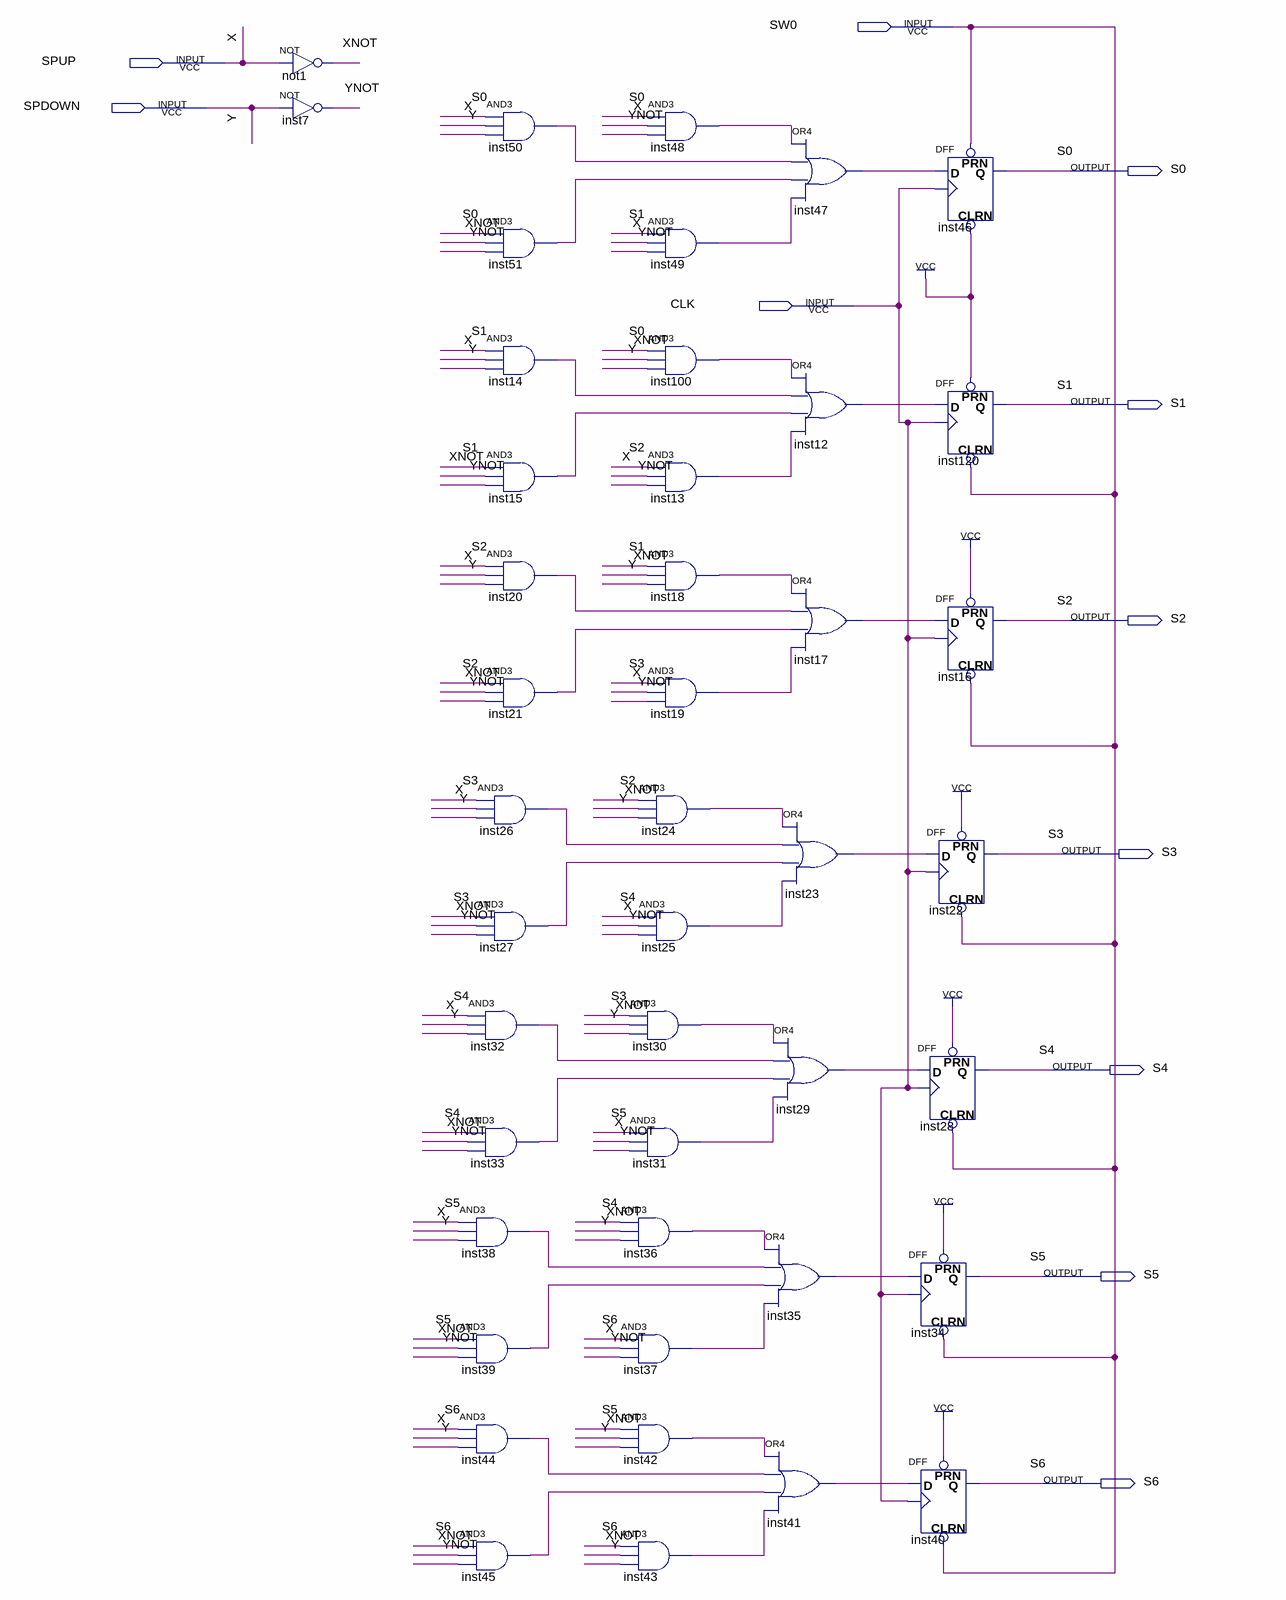
[diagram p0: schematic sheet]
// Quartus schematic nextstatelogic.bdf as structural Verilog: 44 symbols, 11 pins
module nextstatelogic (
  input  SW0,
  input  SPUP,
  input  SPDOWN,
  input  CLK,
  output S0,
  output S1,
  output S2,
  output S3,
  output S4,
  output S5,
  output S6
);

  wire inst12_out, inst13_out, inst14_out, inst15_out, inst17_out, inst18_out, inst19_out, inst20_out,
       inst21_out, inst23_out, inst24_out, inst25_out, inst26_out, inst27_out, inst29_out, inst30_out,
       inst31_out, inst32_out, inst33_out, inst35_out, inst36_out, inst37_out, inst38_out, inst39_out,
       inst41_out, inst42_out, inst43_out, inst44_out, inst45_out, inst47_out, inst48_out, inst49_out,
       inst50_out, inst51_out, inst100_out, XNOT, YNOT;

  not not1 (XNOT, SPUP);
  not inst7 (YNOT, SPDOWN);
  and inst50 (inst50_out, S0, SPUP, SPDOWN);
  and inst51 (inst51_out, S0, XNOT, YNOT);
  and inst14 (inst14_out, S1, SPUP, SPDOWN);
  and inst15 (inst15_out, S1, XNOT, YNOT);
  and inst20 (inst20_out, S2, SPUP, SPDOWN);
  and inst21 (inst21_out, S2, XNOT, YNOT);
  and inst26 (inst26_out, S3, SPUP, SPDOWN);
  and inst27 (inst27_out, S3, XNOT, YNOT);
  and inst32 (inst32_out, S4, SPUP, SPDOWN);
  and inst33 (inst33_out, S4, XNOT, YNOT);
  and inst38 (inst38_out, S5, SPUP, SPDOWN);
  and inst39 (inst39_out, S5, XNOT, YNOT);
  and inst44 (inst44_out, S6, SPUP, SPDOWN);
  and inst45 (inst45_out, S6, XNOT, YNOT);
  and inst30 (inst30_out, S3, XNOT, SPDOWN);
  and inst31 (inst31_out, S5, SPUP, YNOT);
  and inst36 (inst36_out, S4, XNOT, SPDOWN);
  and inst37 (inst37_out, S6, SPUP, YNOT);
  and inst42 (inst42_out, S5, XNOT, SPDOWN);
  and inst43 (inst43_out, S6, XNOT, SPDOWN);
  and inst48 (inst48_out, S0, SPUP, YNOT);
  and inst49 (inst49_out, S1, SPUP, YNOT);
  and inst100 (inst100_out, S0, XNOT, SPDOWN);
  and inst13 (inst13_out, S2, SPUP, YNOT);
  and inst18 (inst18_out, S1, XNOT, SPDOWN);
  and inst19 (inst19_out, S3, SPUP, YNOT);
  and inst24 (inst24_out, S2, XNOT, SPDOWN);
  and inst25 (inst25_out, S4, SPUP, YNOT);
  or inst29 (inst29_out, inst30_out, inst32_out, inst33_out, inst31_out);
  or inst35 (inst35_out, inst36_out, inst38_out, inst39_out, inst37_out);
  or inst41 (inst41_out, inst42_out, inst44_out, inst45_out, inst43_out);
  or inst47 (inst47_out, inst48_out, inst50_out, inst51_out, inst49_out);
  or inst12 (inst12_out, inst100_out, inst14_out, inst15_out, inst13_out);
  or inst17 (inst17_out, inst18_out, inst20_out, inst21_out, inst19_out);
  or inst23 (inst23_out, inst24_out, inst26_out, inst27_out, inst25_out);
  DFF inst28 (.CLRN(SW0), .CLK(CLK), .D(inst29_out), .PRN(1'b1), .Q(S4));
  DFF inst34 (.CLRN(SW0), .CLK(CLK), .D(inst35_out), .PRN(1'b1), .Q(S5));
  DFF inst40 (.CLRN(SW0), .CLK(CLK), .D(inst41_out), .PRN(1'b1), .Q(S6));
  DFF inst46 (.CLRN(1'b1), .CLK(CLK), .D(inst47_out), .PRN(SW0), .Q(S0));
  DFF inst120 (.CLRN(SW0), .CLK(CLK), .D(inst12_out), .PRN(1'b1), .Q(S1));
  DFF inst16 (.CLRN(SW0), .CLK(CLK), .D(inst17_out), .PRN(1'b1), .Q(S2));
  DFF inst22 (.CLRN(SW0), .CLK(CLK), .D(inst23_out), .PRN(1'b1), .Q(S3));

  // Other names for the same wires on the sheet: X = SPUP; Y = SPDOWN
endmodule
